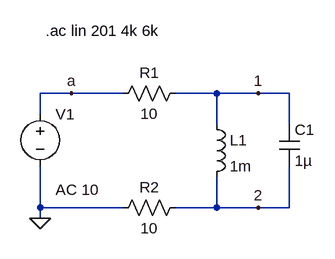
[diagram p0: schematic complex power.asc]
complex power.asc, the LTspice schematic file:
Version 4
SHEET 1 880 680
WIRE 16 128 -32 128
WIRE 96 128 16 128
WIRE 240 128 176 128
WIRE 304 128 240 128
WIRE 352 128 304 128
WIRE -32 160 -32 128
WIRE 240 176 240 128
WIRE 352 176 352 128
WIRE -32 304 -32 240
WIRE 96 304 -32 304
WIRE 240 304 240 256
WIRE 240 304 176 304
WIRE 304 304 240 304
WIRE 352 304 352 240
WIRE 352 304 304 304
WIRE -32 320 -32 304
FLAG -32 320 0
FLAG 304 128 1
FLAG 304 304 2
FLAG 16 128 a
SYMBOL res 80 144 R270
WINDOW 0 32 56 VTop 0
WINDOW 3 0 56 VBottom 0
SYMATTR InstName R1
SYMATTR Value 10
SYMBOL ind 224 160 R0
SYMATTR InstName L1
SYMATTR Value 1m
SYMBOL cap 336 176 R0
SYMATTR InstName C1
SYMATTR Value 1µ
SYMBOL voltage -32 144 R0
WINDOW 123 24 132 Left 0
WINDOW 39 0 0 Left 0
SYMATTR InstName V1
SYMATTR Value ""
SYMATTR Value2 AC 10
SYMBOL res 80 320 R270
WINDOW 0 32 56 VTop 0
WINDOW 3 0 56 VBottom 0
SYMATTR InstName R2
SYMATTR Value 10
TEXT -24 32 Left 0 !.ac lin 201 4k 6k

The netlist it stands for:
* complex power.asc
R1 a 1 10
L1 1 2 1m
C1 1 2 1µ
V1 a 0 AC 10
R2 0 2 10
.ac lin 201 4k 6k
.backanno
.end